# EasyEDA Pro project mini screen.eprj

# Schematic bad usb

## Sheets
1 rp2040: Board Name: bad udb; Create Date: 2025-10-08; Page Name: rp2040; Project Name: mini screen; Schematic Name: bad usb; Update Date: 2025-10-19; Company: EasyEDA.com; Page Size: A4; Version: V1.0
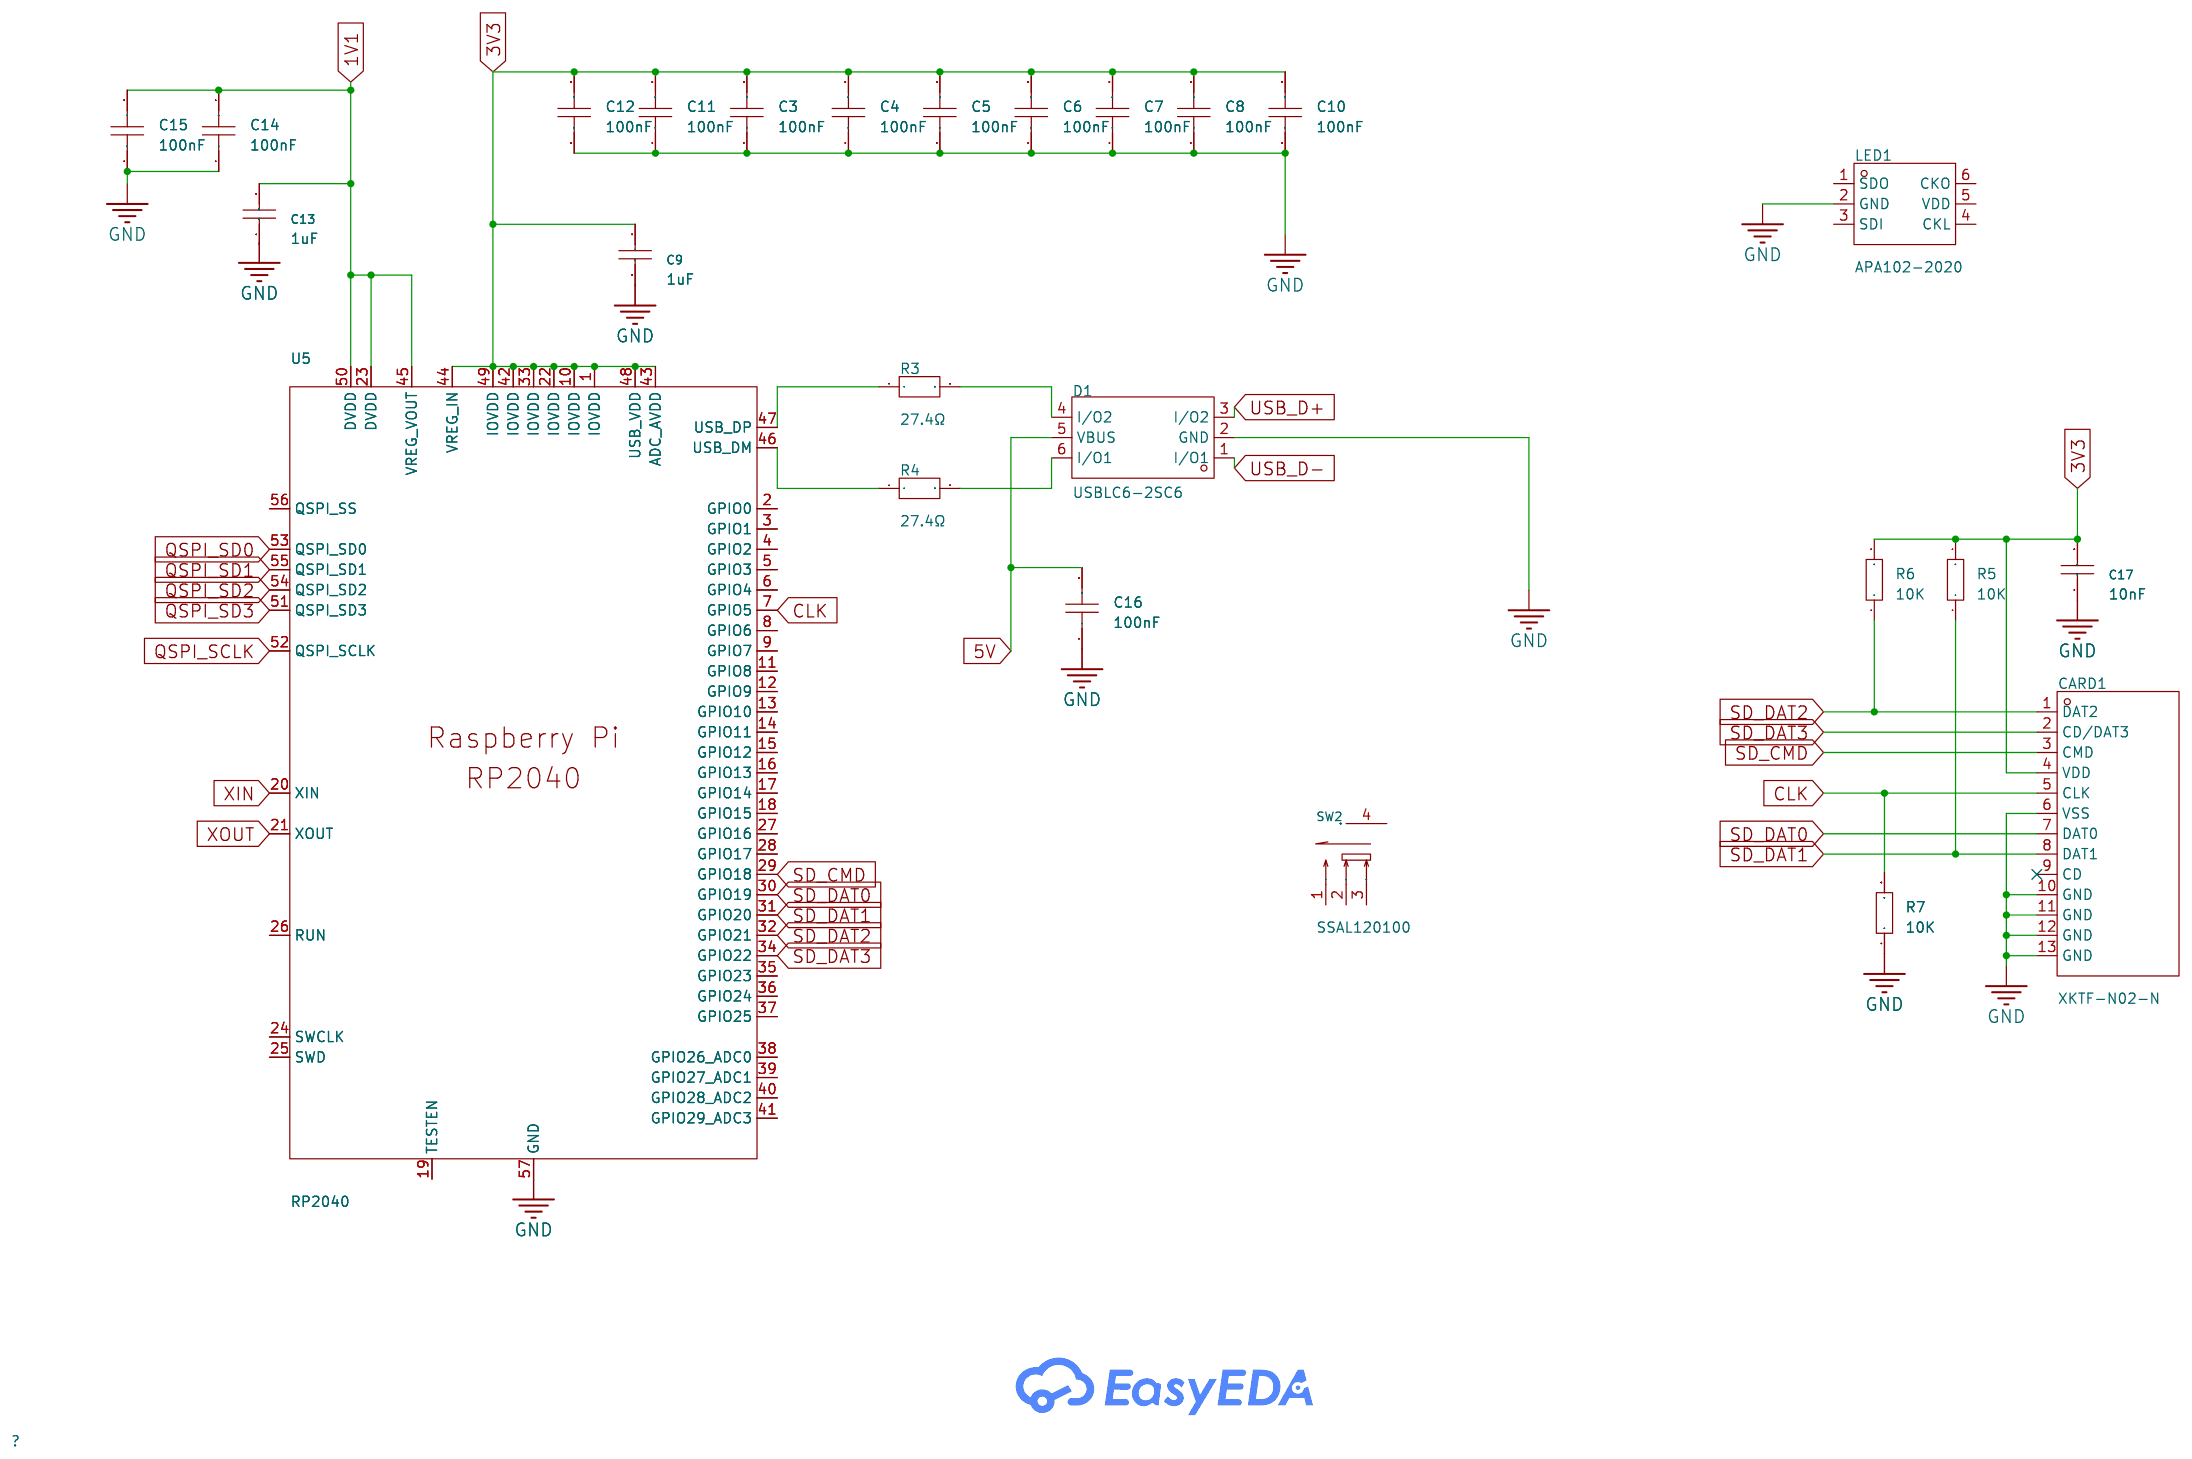
[diagram p0: rp2040]
2 usbc: Create Date: 2025-10-16; Page Name: usbc; Update Date: 2025-10-16
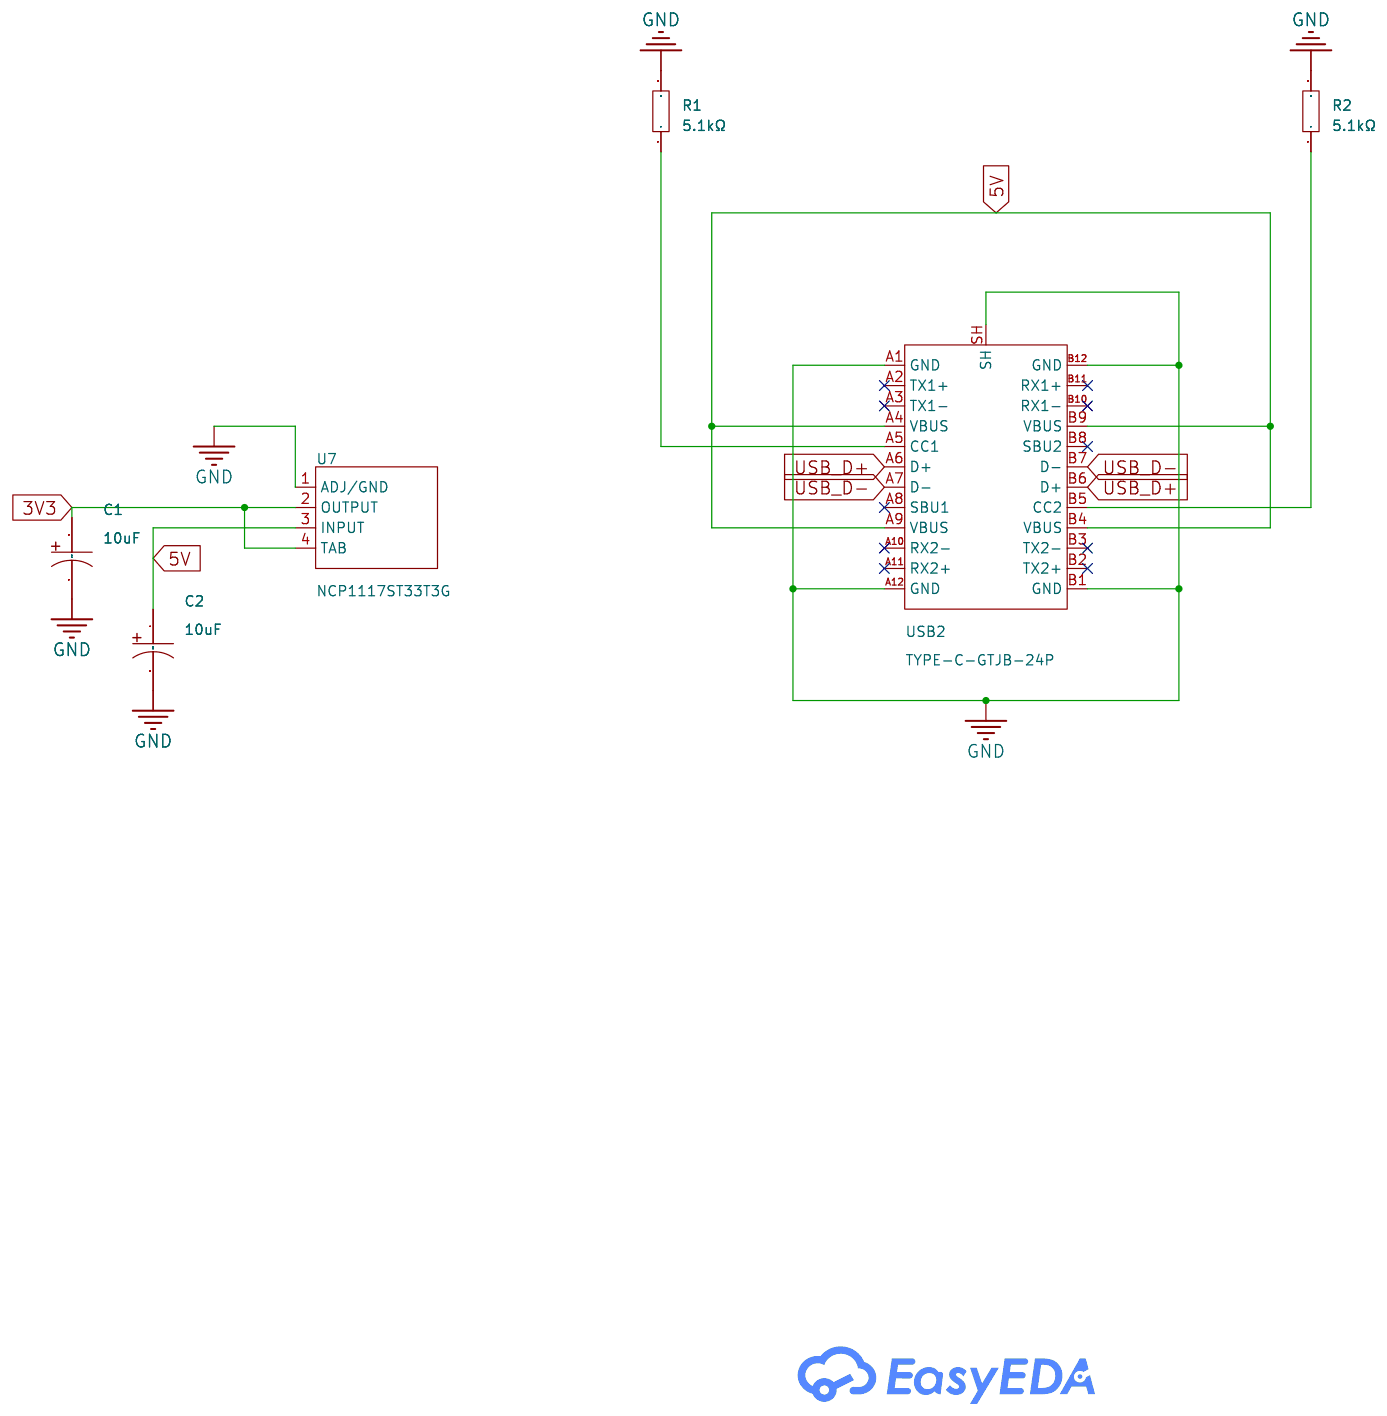
[diagram p1: usbc]
3 nand flash: Create Date: 2025-10-16; Page Name: nand flash; Update Date: 2025-10-16
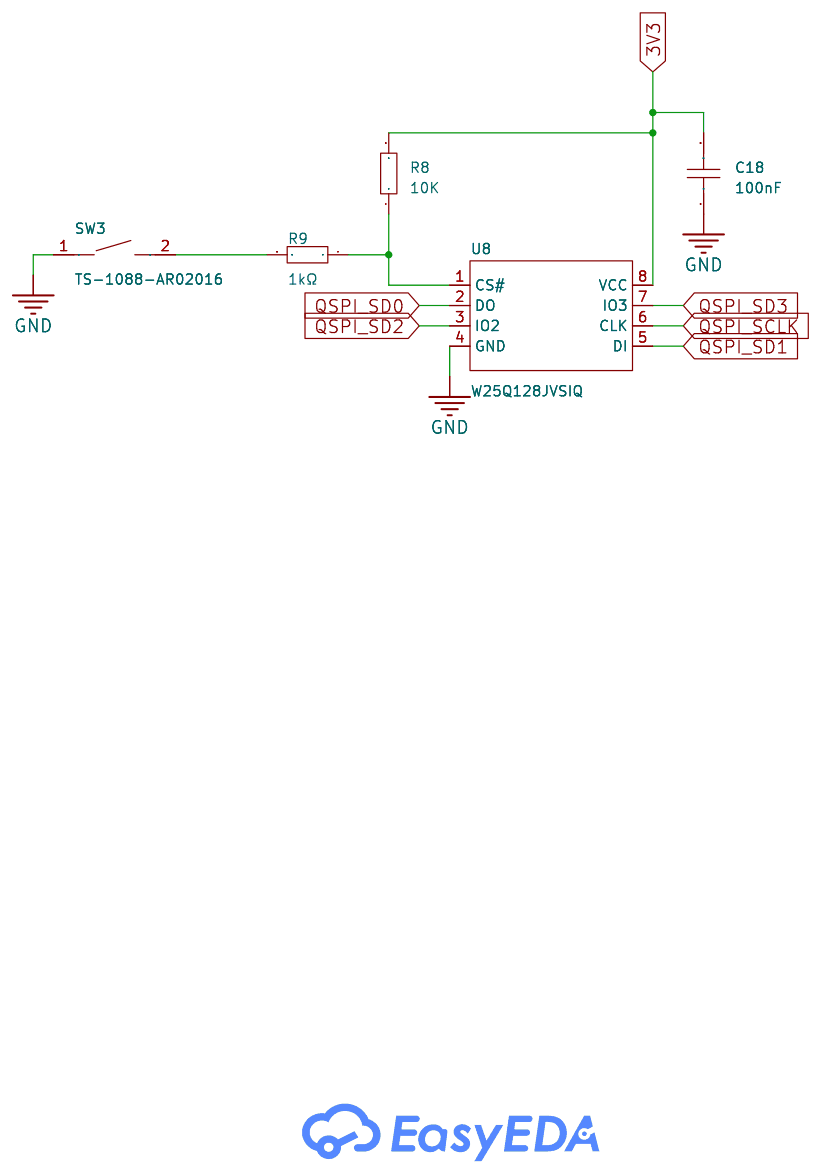
[diagram p2: nand flash]
4 clock: Create Date: 2025-10-19; Page Name: clock
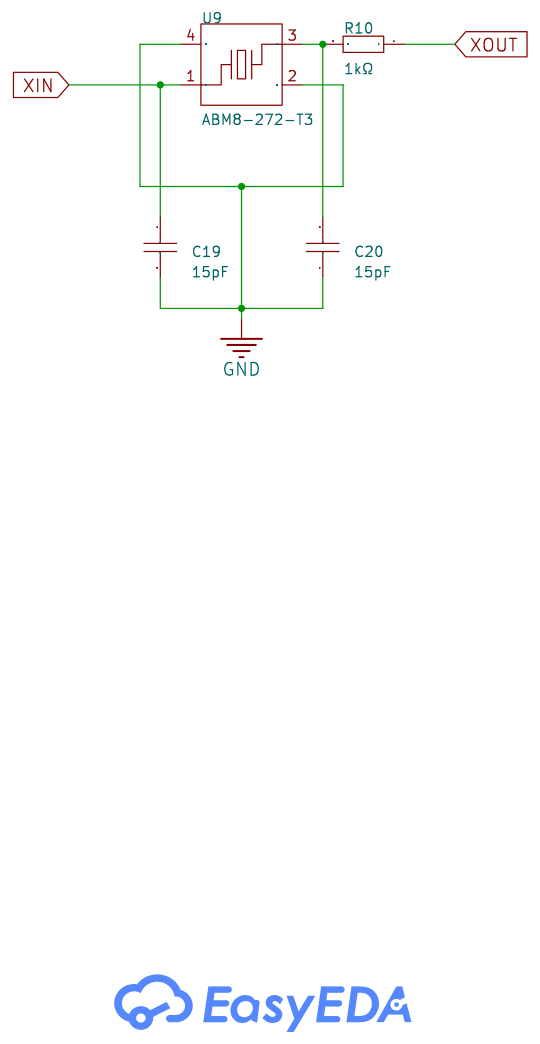
[diagram p3: clock]

## Parts
sheet clock
C19  15pF  [C0603]
C20  15pF  [C0603]
R10  1kΩ  [R0603]
U9  ABM8-272-T3  [CRYSTAL-SMD_4P-L3.2-W2.5-BL]
sheet nand flash
C18  100nF  [C0805]
R8  10K  [R0603]
R9  1kΩ  [R0603]
SW3  TS-1088-AR02016  [SW-SMD_L3.9-W3.0-P4.45]
U8  W25Q128JVSIQ  [SOIC-8_L5.3-W5.3-P1.27-LS8.0-BL]
sheet rp2040
C3  100nF  [C0805]
C4  100nF  [C0805]
C5  100nF  [C0805]
C6  100nF  [C0805]
C7  100nF  [C0805]
C8  100nF  [C0805]
C9  1uF  [C0805]
C10  100nF  [C0805]
C11  100nF  [C0805]
C12  100nF  [C0805]
C13  1uF  [C0805]
C14  100nF  [C0805]
C15  100nF  [C0805]
C16  100nF  [C0805]
C17  10nF  [C0603]
CARD1  XKTF-N02-N  [TF-SMD_XKTF-N02-N]
D1  USBLC6-2SC6  [SOT-23-6_L2.9-W1.6-P0.95-LS2.8-BL]
LED1  APA102-2020  [LED-SMD_6P-L2.0-W2.0-P0.80-TL]
R3  27.4Ω  [R0603]
R4  27.4Ω  [R0603]
R5  10K  [R0603]
R6  10K  [R0603]
R7  10K  [R0603]
SW2  SSAL120100  [SW-SMD_SSAL120100]
U5  RP2040  [QFN-56_L7.0-W7.0-P0.40-TL-EP4.0]
sheet usbc
C1  10uF  [CAP-SMD_BD4.0-L4.3-W4.3-FD]
C2  10uF  [CAP-SMD_BD4.0-L4.3-W4.3-FD]
R1  5.1kΩ  [R0603]
R2  5.1kΩ  [R0603]
U7  NCP1117ST33T3G  [SOT-223-3_L6.5-W3.4-P2.30-LS7.0-BR]
USB2  TYPE-C-GTJB-24P  [USB-C-SMD_TYPE-C-GTJB-24P]

## Library data of the parts
C19 C20 = CL10C150JB8NNNC: LCSC Part Name: 15pF ±5% 50V; Supplier Part: C1644; Manufacturer: SAMSUNG(三星); Supplier Footprint: 0603; JLCPCB Part Class: Basic Part; Datasheet: https://item.szlcsc.com/datasheet/CL10C150JB8NNNC/1996.html; Supplier: LCSC; Tolerance: ±5%; Voltage Rating: 50V; Temperature Coefficient: C0G
R9 R10 = 0603WAF1001T5E: LCSC Part Name: 1kΩ ±1% 100mW 厚膜电阻; Supplier Part: C21190; Manufacturer: UNI-ROYAL(厚声); Supplier Footprint: 0603; JLCPCB Part Class: Basic Part; Datasheet: https://atta.szlcsc.com/upload/public/pdf/source/20200306/C422600_1E6D84923E4A46A82E41ADD87F860B5C.pdf; Supplier: LCSC; Type: Thick Film Resistors; Tolerance: ±1%; Temperature Coefficient: ±100ppm/℃; Operating Temperature Range: -55℃~+155℃
U9 = ABM8-272-T3_C20625731: Supplier Part: C20625731; Manufacturer: ABRACON; Supplier Footprint: SMD3225-4P; JLCPCB Part Class: Extended Part; Datasheet: https://item.szlcsc.com/datasheet/ABM8-272-T3/22032038.html; Supplier: LCSC
C3-C8 C10-C12 C14-C16 C18 = CC0805KRX7R9BB104: LCSC Part Name: 100nF ±10% 50V; Supplier Part: C49678; Manufacturer: YAGEO(国巨); Supplier Footprint: 0805; JLCPCB Part Class: Basic Part; Datasheet: https://item.szlcsc.com/datasheet/CC0805KRX7R9BB104/50686.html; Supplier: LCSC; Tolerance: ±10%; Voltage Rating: 50V; Temperature Coefficient: X7R
R5-R8 = Res_0603: Supplier Footprint: 0603
SW3 = TS-1088-AR02016: LCSC Part Name: 4*3*2mm 立贴 轻触开关; Supplier Part: C720477; Manufacturer: XUNPU(讯普); Supplier Footprint: SMD; JLCPCB Part Class: Basic Part; Datasheet: https://item.szlcsc.com/datasheet/TS-1088-AR02016/763484.html; Supplier: LCSC; Circuit: SPST; Actuator Style: Round Button; Operating Force: 1.6N; Mounting Type: Surface Mount,Vertical; Length: 4mm; Width: 3mm; Switch Height: 2mm; with Bracket: Without Bracket; Contact Current: 50mA; Voltage Rating: 12V; Actuator/Cap Color: Black; Termination Style: SMD(SMT) Tab; Life: 100,000 Cycles; Operating Temperature: -30℃~+80℃
U8 = W25Q128JVSIQ: LCSC Part Name: 编带 支持双路/四路SPI接口的3V、128Mbit 串行闪存; Supplier Part: C97521; Manufacturer: Winbond(华邦); Supplier Footprint: SOIC-8-208mil; JLCPCB Part Class: Basic Part; Datasheet: https://item.szlcsc.com/datasheet/W25Q128JVSIQ/98729.html; Supplier: LCSC; Interface: SPI; Memory Size: 128Mbit; Clock Frequency: 133MHz; Voltage - Supply: 2.7V~3.6V; Standby Supply Current: 1uA; Program / Erase Cycles: 100,000 Cycles; Page Programming Time (Tpp): 3ms; Block Erase Time(tBE): 120ms@(32KB); Data Retention - TDR (Year): 20 Years; Operating Temperature: -40℃~+85℃
C9 C13 = CL21B105KBFNNNE: LCSC Part Name: 1uF ±10% 50V; Supplier Part: C28323; Manufacturer: SAMSUNG(三星); Supplier Footprint: 0805; JLCPCB Part Class: Basic Part; Datasheet: https://item.szlcsc.com/datasheet/CL21B105KBFNNNE/29074.html; Supplier: LCSC; Tolerance: ±10%; Voltage Rating: 50V; Temperature Coefficient: X7R
C17 = 0603B103K500NT: LCSC Part Name: 10nF ±10% 50V; Supplier Part: C57112; Manufacturer: FH(风华); Supplier Footprint: 0603; JLCPCB Part Class: Basic Part; Datasheet: https://item.szlcsc.com/datasheet/0603B103K500NT/58143.html; Supplier: LCSC; Tolerance: ±10%; Voltage Rating: 50V; Temperature Coefficient: X7R
CARD1 = XKTF-N02-N: LCSC Part Name: 自弹式 MicroSD卡(TF卡) 卡座; Supplier Part: C381084; Manufacturer: XKB Connection(中国星坤); Supplier Footprint: SMD; JLCPCB Part Class: Extended Part; Datasheet: https://item.szlcsc.com/datasheet/XKTF-N02-N/353316.html; Supplier: LCSC; Card Connection Mode: Push-Push; Card Type: MicroSD Card (TF Card); Connector Type: Connector and Ejector; Height Above Board: 2mm; Operating Temperature: -25℃~+90℃
D1 = USBLC6-2SC6_C2687116: Supplier Part: C2687116; Manufacturer: UMW(友台半导体); Supplier Footprint: SOT-23-6; JLCPCB Part Class: Extended Part; Datasheet: https://atta.szlcsc.com/upload/public/pdf/source/20231109/512642D850D9873E7C519F71E85B9A10.pdf; Supplier: LCSC; Maximum Clamping Voltage: 15V; Breakdown Voltage: 6V; Number of Lines: 双路; Type: ESD
LED1 = APA102-2020: Supplier Part: C9900001305; Supplier Footprint: LED-SMD-6_2.0X2.0X0.80P; JLCPCB Part Class: Extended Part; Supplier: LCSC
R3 R4 = FRC0603F27R4TS: LCSC Part Name: 27.4Ω ±1% 100mW 厚膜电阻; Supplier Part: C5126244; Manufacturer: FOJAN(富捷); Supplier Footprint: 0603; JLCPCB Part Class: Extended Part; Supplier: LCSC; Type: Thick Film Resistor; Tolerance: ±1%; Power(Watts): 100mW; Voltage-Supply(Max): 75V; Temperature Coefficient: ±100ppm/℃; Operating Temperature: -55℃~+155℃
SW2 = SSAL120100: Supplier Part: C335996; Manufacturer: ALPSALPINE(阿尔卑斯阿尔派); Supplier Footprint: SMD; JLCPCB Part Class: Extended Part; Datasheet: https://item.szlcsc.com/datasheet/SSAL120100/314151.html; Supplier: LCSC; Circuit: SPDT; Actuator Style: Rectangular Columnar; Termination Style: SMD(SMT) Tab; Switch Height: 4.1mm; Mounting Type: Surface Mount, Right Angle; Current Rating: 10mA; Voltage Rating: 5V; Life: 100,000 Cycles; Operating Temperature: -10℃~+60℃
U5 = RP2040: Supplier Part: C2961140; Manufacturer: Raspberry Pi(树莓派); Supplier Footprint: QFN-56-EP(7x7); JLCPCB Part Class: Extended Part; Datasheet: https://atta.szlcsc.com/upload/public/pdf/source/20220208/8D54DD1C91A7987165C42A5C4D6BB336.pdf; Supplier: LCSC
C1 C2 = EEEHP1A100R: LCSC Part Name: 10uF ±20% 10V; Supplier Part: C401860; Manufacturer: PANASONIC(松下); Supplier Footprint: SMD,D4xL5.8mm; JLCPCB Part Class: Extended Part; Datasheet: https://item.szlcsc.com/datasheet/EEEHP1A100R/386788.html; Supplier: LCSC; Tolerance: ±20%; Voltage Rating: 10V; Ripple Current: 20mA@120Hz; Diameter: 4mm; Height - Seated (Max): 5.9mm; Lifetime: 2000hrs@105℃; Operating Temperature: -40℃~+105℃
R1 R2 = 0603WAF5101T5E: LCSC Part Name: 5.1kΩ ±1% 100mW 厚膜电阻; Supplier Part: C23186; Manufacturer: UNI-ROYAL(厚声); Supplier Footprint: 0603; JLCPCB Part Class: Basic Part; Datasheet: https://item.szlcsc.com/datasheet/0603WAF5101T5E/23913.html; Supplier: LCSC; Type: Thick Film Resistor; Tolerance: ±1%; Power(Watts): 100mW; Voltage-Supply(Max): 75V; Temperature Coefficient: ±100ppm/℃; Operating Temperature: -55℃~+155℃
U7 = NCP1117ST33T3G: LCSC Part Name: 输入20V 输出3.3V 1A; Supplier Part: C26537; Manufacturer: onsemi(安森美); Supplier Footprint: SOT-223; JLCPCB Part Class: Extended Part; Datasheet: https://item.szlcsc.com/datasheet/NCP1117ST33T3G/27282.html; Supplier: LCSC; Output Type: Fixed; Voltage - Supply: 20V; Output Voltage: 3.3V; Output Current: 1A; Power Supply Rejection Ratio (PSRR): 62dB@(120Hz); Voltage Dropout: 1.2V@(800mA); standby current: 6mA; Noise: 0.003%Vout; Features: Thermal Shutdown；Over Current Protection; Operating Temperature: 0℃~+125℃@(Ta); Output Configuration: Positive; Number of Outputs: 1
USB2 = TYPE-C-GTJB-24P: LCSC Part Name: Type-C 公 夹板; Supplier Part: C42418805; Manufacturer: JXTCONN(聚兴泰); Supplier Footprint: SMD; JLCPCB Part Class: Extended Part; Datasheet: https://item.szlcsc.com/datasheet/TYPE-C-GTJB-24P/44427956.html; Supplier: LCSC; Connector Type: Type-C; Gender: Male; Mounting Type: Clamp Plate; Number of Contacts: 24P; Number of Ports: 1; Current Rating-Power: 3A; Connect-Disconnect Life: 3,000 Cycles; Length: 10.4mm

## Nets
1V1: C13.2 C14.2 C15.2 U5.23(DVDD) U5.45(VREG_VOUT) U5.50(DVDD)
3V3: C1.1 C3.2 C4.2 C5.2 C6.2 C7.2 C8.2 C9.2 C10.2 C11.2 C12.2 C17.2 C18.2 CARD1.4(VDD) R5.2 R6.2 R8.2 U5.1(IOVDD) U5.10(IOVDD) U5.22(IOVDD) U5.33(IOVDD) U5.42(IOVDD) U5.43(ADC_AVDD) U5.44(VREG_IN) U5.48(USB_VDD) U5.49(IOVDD) U7.2(OUTPUT) U7.4(TAB) U8.8(VCC)
5V: C2.1 C16.2 D1.5(VBUS) U7.3(INPUT) USB2.A4(VBUS) USB2.A9(VBUS) USB2.B4(VBUS) USB2.B9(VBUS)
GND: C1.2 C2.2 C3.1 C4.1 C5.1 C6.1 C7.1 C8.1 C9.1 C10.1 C11.1 C12.1 C13.1 C14.1 C15.1 C16.1 C17.1 C18.1 C19.2 C20.1 CARD1.6(VSS) CARD1.10(GND) CARD1.11(GND) CARD1.12(GND) CARD1.13(GND) D1.2(GND) LED1.2(GND) R1.2 R2.2 R7.1 SW3.1 U5.57(GND) U7.1(ADJ/GND) U8.4(GND) U9.2(GND) U9.4(GND) USB2.A1(GND) USB2.A12(GND) USB2.B1(GND) USB2.B12(GND) USB2.SH
CLK: CARD1.5(CLK) R7.2 U5.7(GPIO5)
QSPI_SCLK: U5.52(QSPI_SCLK) U8.6(CLK)
QSPI_SD0: U5.53(QSPI_SD0) U8.2(DO)
QSPI_SD1: U5.55(QSPI_SD1) U8.5(DI)
QSPI_SD2: U5.54(QSPI_SD2) U8.3(IO2)
QSPI_SD3: U5.51(QSPI_SD3) U8.7(IO3)
SD_CMD: CARD1.3(CMD) U5.29(GPIO18)
SD_DAT0: CARD1.7(DAT0) U5.30(GPIO19)
SD_DAT1: CARD1.8(DAT1) R5.1 U5.31(GPIO20)
SD_DAT2: CARD1.1(DAT2) R6.1 U5.32(GPIO21)
SD_DAT3: CARD1.2(CD/DAT3) U5.34(GPIO22)
USB_D+: D1.3(I/O2) USB2.A6(D+) USB2.B6(D+)
USB_D-: D1.1(I/O1) USB2.A7(D-) USB2.B7(D-)
XIN: C19.1 U5.20(XIN) U9.1
XOUT: R10.1 U5.21(XOUT)
$1N4416: D1.4(I/O2) R3.2
$1N4421: D1.6(I/O1) R4.2
$1N4426: R4.1 U5.46(USB_DM)
$1N4431: R3.1 U5.47(USB_DP)
$2N850: R2.1 USB2.B5(CC2)
$2N855: R1.1 USB2.A5(CC1)
$3N520: R8.1 R9.1 U8.1(CS#)
$3N750: R9.2 SW3.2
$4N535: C20.2 R10.2 U9.3

Not connected (* = marked no-connect by the designer): CARD1 9(CD)*; LED1 1(SDO) 3(SDI) 4(CKL) 5(VDD) 6(CKO); SW2 1 2 3 4(SHELL); U5 2(GPIO0) 3(GPIO1) 4(GPIO2) 5(GPIO3) 6(GPIO4) 8(GPIO6) 9(GPIO7) 11(GPIO8) 12(GPIO9) 13(GPIO10) 14(GPIO11) 15(GPIO12) 16(GPIO13) 17(GPIO14) 18(GPIO15) 19(TESTEN) 24(SWCLK) 25(SWD) 26(RUN) 27(GPIO16) 28(GPIO17) 35(GPIO23) 36(GPIO24) 37(GPIO25) 38(GPIO26_ADC0) 39(GPIO27_ADC1) 40(GPIO28_ADC2) 41(GPIO29_ADC3) 56(QSPI_SS); USB2 A2(TX1+)* A3(TX1-)* A8(SBU1)* A10(RX2-)* A11(RX2+)* B2(TX2+)* B3(TX2-)* B8(SBU2)* B10(RX1-)* B11(RX1+)*

# Board PCB1
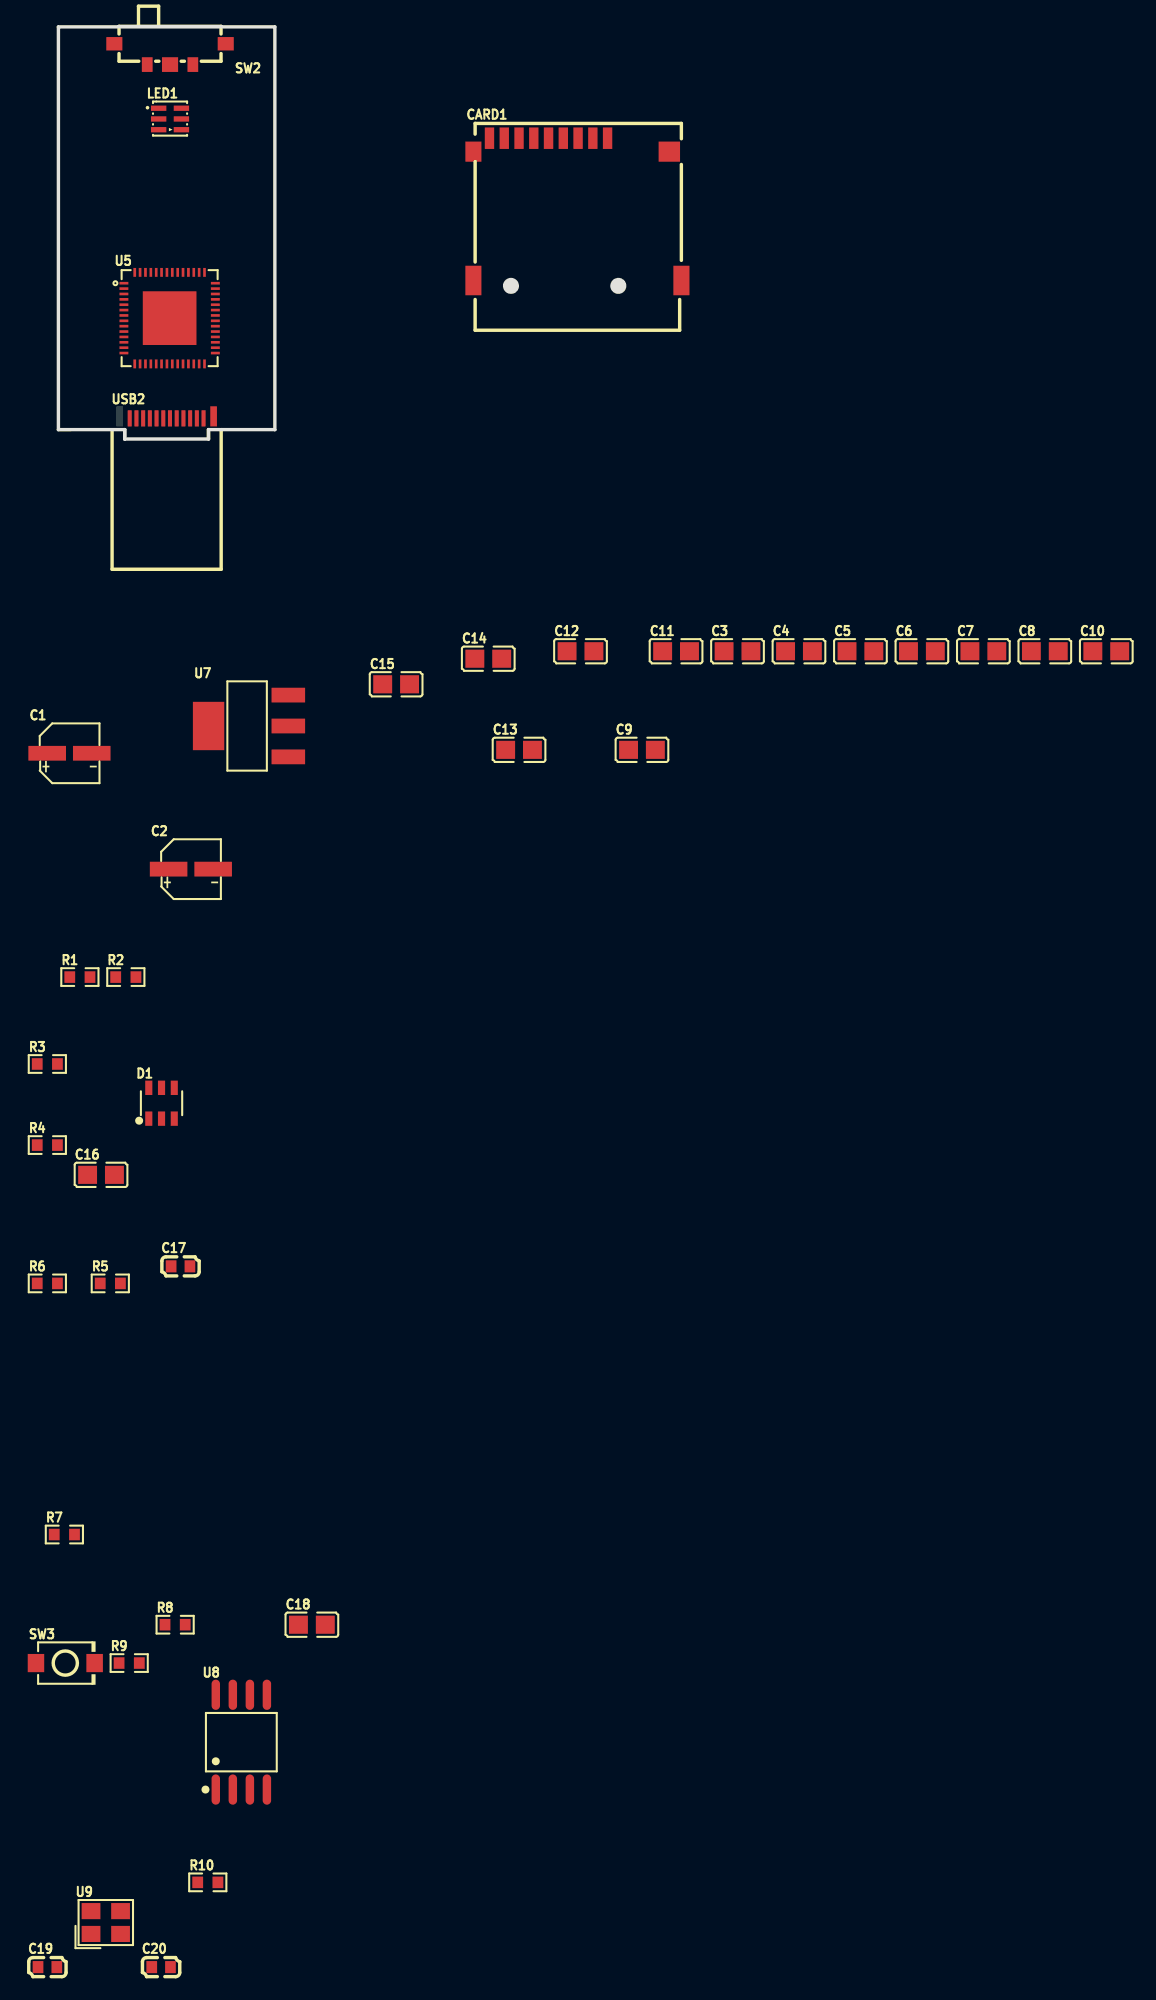
[diagram p4: board, top side]
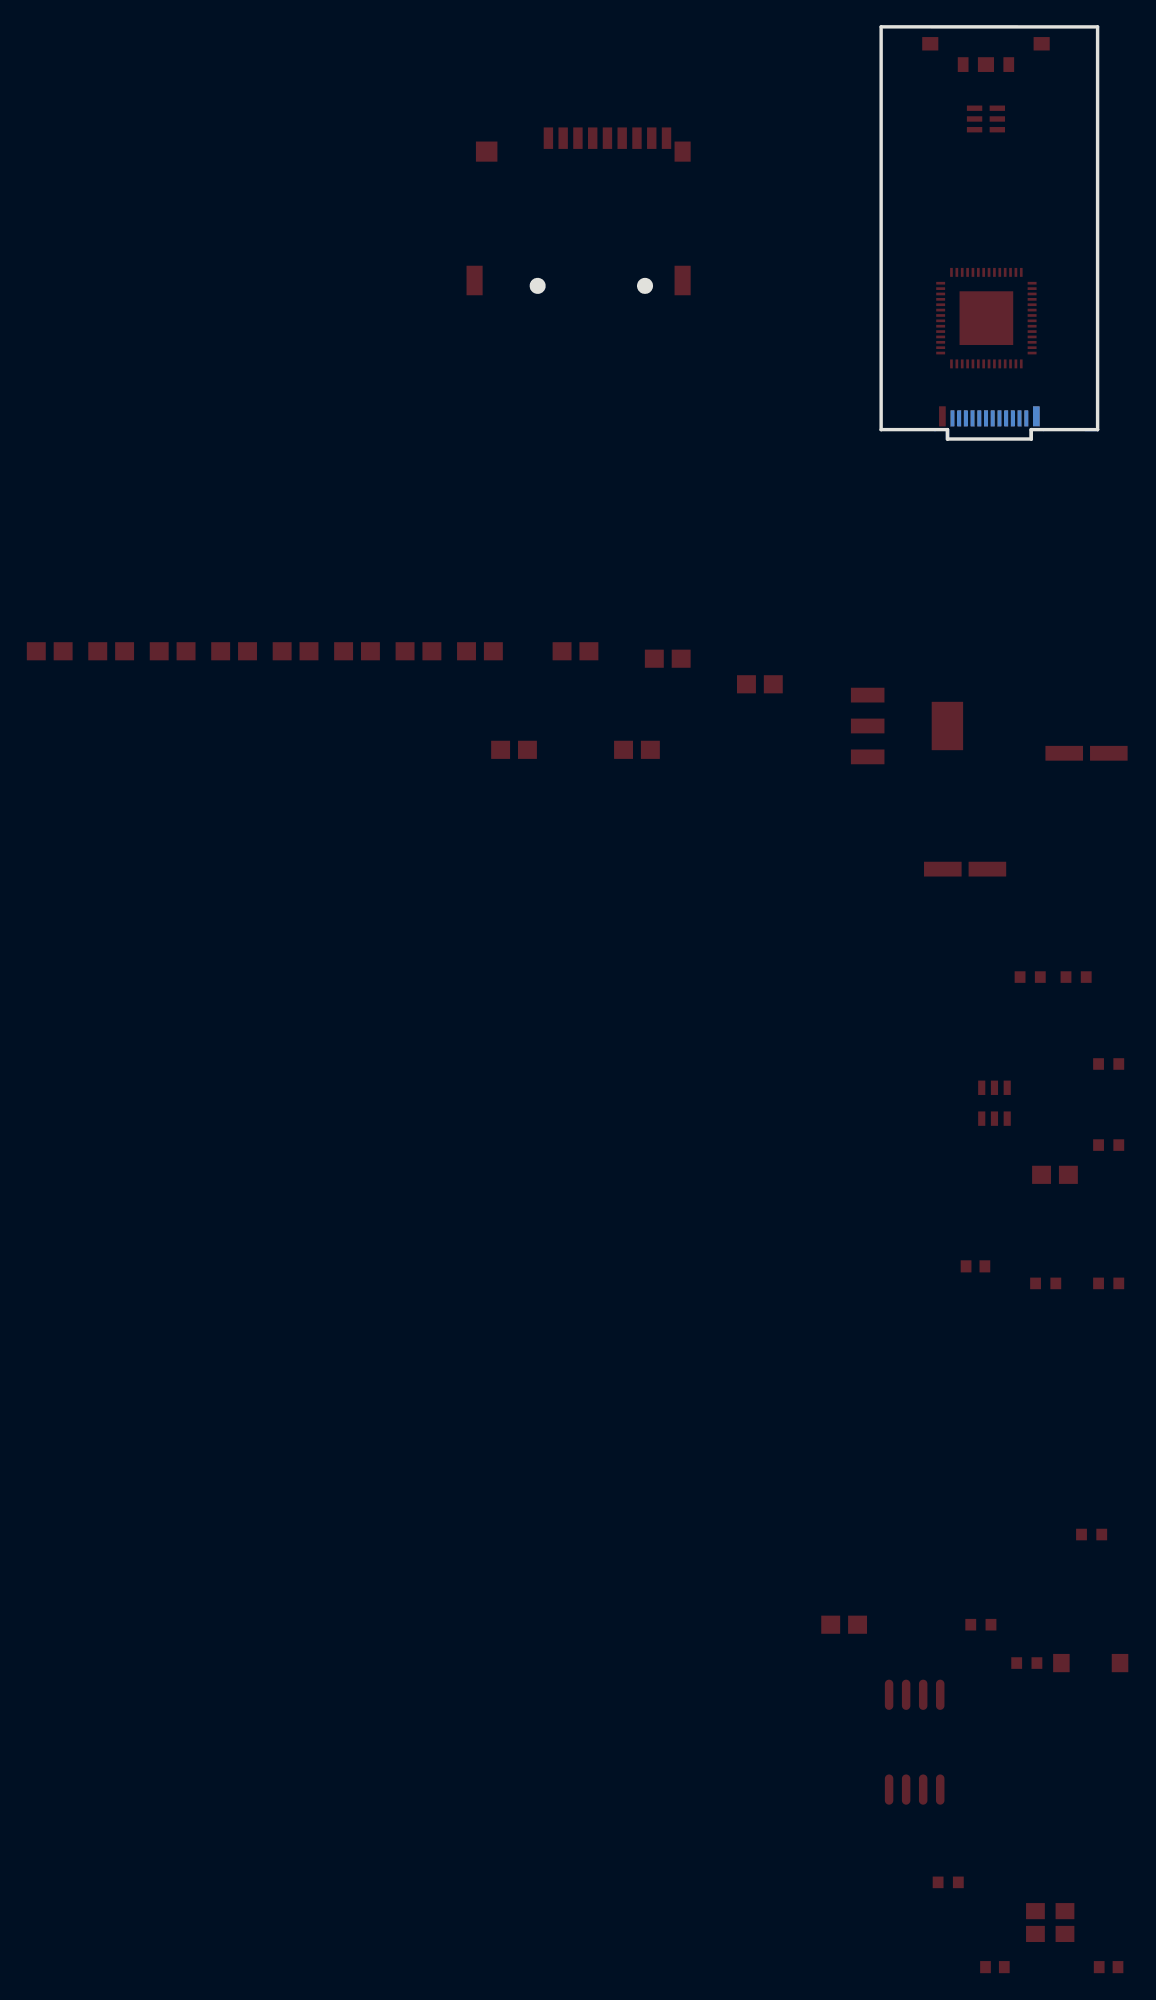
[diagram p5: board, bottom side, seen from below]

Outline 42.32 x 30.7 mm; copper layers: Top Layer, Bottom Layer. Coordinates in mm from the lower left corner of the outline.
Outline path: 4,0.7 0,0.7 0,30.7 16.13,30.7 16.13,0.7 12.13,0.7
Stack: Top Layer 0.035mm / Dielectric1 1.51mm FR4 er 4.5 / Bottom Layer 0.035mm

## Design rules (mm)
template: JLCPCB Capability(Two Layers Board)
spacing copperThickness1oz (default): track to track 0.102, other pairs 0.152 to 0.3
spacing copperThickness2oz: track to track 0.203, other pairs 0.152 to 0.3
track width copperThickness1oz (default): min 0.127, default 0.254, max 2.54
track width copperThickness2oz: min 0.203, default 0.254, max 2.54
differential pair differentialPair (default): width min 0.127, default 0.254, max 2.54; gap min 0.152, default 0.152
via viaSize (default): diameter min 0.5, default 0.61, max 10; hole min 0.3, default 0.305, max 6.3

## Placement (name value [footprint] x y rotation side)
C1  10uF  [CAP-SMD_BD4.0-L4.3-W4.3-FD]  0.82 -23.41 0 top
C2  10uF  [CAP-SMD_BD4.0-L4.3-W4.3-FD]  9.87 -32.04 0 top
C3  100nF  [C0805]  50.6 -15.81 0 top
C4  100nF  [C0805]  55.18 -15.81 0 top
C5  100nF  [C0805]  59.76 -15.81 0 top
C6  100nF  [C0805]  64.34 -15.81 0 top
C7  100nF  [C0805]  68.92 -15.81 0 top
C8  100nF  [C0805]  73.5 -15.81 0 top
C9  1uF  [C0805]  43.48 -23.15 0 top
C10  100nF  [C0805]  78.08 -15.81 0 top
C11  100nF  [C0805]  46.02 -15.81 0 top
C12  100nF  [C0805]  38.9 -15.81 0 top
C13  1uF  [C0805]  34.32 -23.15 0 top
C14  100nF  [C0805]  32.03 -16.36 0 top
C15  100nF  [C0805]  25.16 -18.27 0 top
C16  100nF  [C0805]  3.18 -54.8 0 top
C17  10nF  [C0603]  9.1 -61.62 0 top
C18  100nF  [C0805]  18.89 -88.31 0 top
C19  15pF  [C0603]  -0.82 -113.81 0 top
C20  15pF  [C0603]  7.65 -113.81 0 top
CARD1  XKTF-N02-N  [TF-SMD_XKTF-N02-N]  38.67 17.11 0 top
D1  USBLC6-2SC6  [SOT-23-6_L2.9-W1.6-P0.95-LS2.8-BL]  7.68 -49.47 0 top
LED1  APA102-2020  [LED-SMD_6P-L2.0-W2.0-P0.80-TL]  8.32 23.84 0 top
R1  5.1kΩ  [R0603]  1.6 -40.07 0 top
R2  5.1kΩ  [R0603]  5.02 -40.07 0 top
R3  27.4Ω  [R0603]  -0.83 -46.55 0 top
R4  27.4Ω  [R0603]  -0.83 -52.59 0 top
R5  10K  [R0603]  3.87 -62.89 0 top
R6  10K  [R0603]  -0.83 -62.89 0 top
R7  10K  [R0603]  0.44 -81.59 0 top
R8  10K  [R0603]  8.7 -88.31 0 top
R9  1kΩ  [R0603]  5.28 -91.17 0 top
R10  1kΩ  [R0603]  11.13 -107.5 0 top
SW2  SSAL120100  [SW-SMD_SSAL120100]  8.32 28.66 180 top
SW3  TS-1088-AR02016  [SW-SMD_L3.9-W3.0-P4.45]  0.51 -91.17 0 top
U5  RP2040  [QFN-56_L7.0-W7.0-P0.40-TL-EP4.0]  8.29 9 0 top
U7  NCP1117ST33T3G  [SOT-223-3_L6.5-W3.4-P2.30-LS7.0-BR]  14.16 -21.37 0 top
U8  W25Q128JVSIQ  [SOIC-8_L5.3-W5.3-P1.27-LS8.0-BL]  13.63 -97.06 0 top
U9  ABM8-272-T3  [CRYSTAL-SMD_4P-L3.2-W2.5-BL]  3.53 -110.49 0 top
USB2  TYPE-C-GTJB-24P  [USB-C-SMD_TYPE-C-GTJB-24P]  8.06 1.61 0 top

## Footprints (pads in the part's own frame, mm; a bottom-side part is the same pattern mirrored in y, then rotated)
C0603
  rect 0.8x0.9 smd: 1(-0.7,0) 2(0.7,0)
C0805
  rect 1.41x1.35 smd: 1(-1,0) 2(1,0)
CAP-SMD_BD4.0-L4.3-W4.3-FD
  rect 2.8x1.1 smd: 1(-1.661,0) 2(1.661,0)
CRYSTAL-SMD_4P-L3.2-W2.5-BL
  rect 1.4x1.2 smd: 1(-1.1,-0.85) 2(1.1,-0.85) 3(1.1,0.85) 4(-1.1,0.85)
LED-SMD_6P-L2.0-W2.0-P0.80-TL
  rect 1.145x0.4 smd: 1(-0.848,0.8) 2(-0.848,0) 3(-0.848,-0.8) 4(0.848,-0.8) 5(0.848,0) 6(0.848,0.8)
QFN-56_L7.0-W7.0-P0.40-TL-EP4.0
  rect 0.665x0.2 smd: 1(-3.408,2.6) 2(-3.408,2.2) 3(-3.408,1.8) 4(-3.408,1.4) 5(-3.408,1) 6(-3.408,0.6) 7(-3.408,0.2) 8(-3.408,-0.2) 9(-3.408,-0.6) 10(-3.408,-1) 11(-3.408,-1.4) 12(-3.408,-1.8) 13(-3.408,-2.2) 14(-3.408,-2.6) 29(3.408,-2.6) 30(3.408,-2.2) 31(3.408,-1.8) 32(3.408,-1.4) 33(3.408,-1) 34(3.408,-0.6) 35(3.408,-0.2) 36(3.408,0.2) 37(3.408,0.6) 38(3.408,1) 39(3.408,1.4) 40(3.408,1.8) 41(3.408,2.2) 42(3.408,2.6)
  rect 0.2x0.665 smd: 15(-2.6,-3.408) 16(-2.2,-3.408) 17(-1.8,-3.408) 18(-1.4,-3.408) 19(-1,-3.408) 20(-0.6,-3.408) 21(-0.2,-3.408) 22(0.2,-3.408) 23(0.6,-3.408) 24(1,-3.408) 25(1.4,-3.408) 26(1.8,-3.408) 27(2.2,-3.408) 28(2.6,-3.408) 43(2.6,3.408) 44(2.2,3.408) 45(1.8,3.408) 46(1.4,3.408) 47(1,3.408) 48(0.6,3.408) 49(0.2,3.408) 50(-0.2,3.408) 51(-0.6,3.408) 52(-1,3.408) 53(-1.4,3.408) 54(-1.8,3.408) 55(-2.2,3.408) 56(-2.6,3.408)
  rect 4x4 smd: 57(0,0)
R0603
  rect 0.806x0.864 smd: 1(-0.753,0) 2(0.753,0)
SOIC-8_L5.3-W5.3-P1.27-LS8.0-BL
  oval 0.63x2.25 smd: 1(-1.905,-3.53) 2(-0.635,-3.53) 3(0.635,-3.53) 4(1.905,-3.53) 5(1.905,3.53) 6(0.635,3.53) 7(-0.635,3.53) 8(-1.905,3.53)
SOT-23-6_L2.9-W1.6-P0.95-LS2.8-BL
  rect 0.532x1.072 smd: 1(-0.95,-1.149) 2(0,-1.149) 3(0.95,-1.149) 4(0.95,1.149) 5(0,1.149) 6(-0.95,1.149)
SOT-223-3_L6.5-W3.4-P2.30-LS7.0-BR
  rect 2.5x1.1 smd: 1(2.97,-2.3) 2(2.97,0) 3(2.97,2.3)
  rect 2.34x3.6 smd: 4(-2.97,0)
SW-SMD_L3.9-W3.0-P4.45
  rect 1.23x1.36 smd: 1(-2.185,0) 2(2.185,0)
SW-SMD_SSAL120100
  rect 0.8x1.1 smd: 1(-1.7,0.775) 3(1.7,0.775)
  rect 1.2x1.1 smd: 2(0,0.775)
  rect 1.2x1 smd: 4(-4.15,-0.775) 4(4.15,-0.775)
TF-SMD_XKTF-N02-N
  rect 0.7x1.6 smd: 1(2.25,5.3) 2(1.15,5.3) 3(0.05,5.3) 4(-1.05,5.3) 5(-2.15,5.3) 6(-3.25,5.3) 7(-4.35,5.3) 8(-5.45,5.3) 9(-6.55,5.3)
  rect 1.2x1.5 smd: 10(-7.75,4.3)
  rect 1.2x2.2 smd: 11(-7.75,-5.3) 13(7.75,-5.3)
  rect 1.6x1.5 smd: 12(6.85,4.3)
USB-C-SMD_TYPE-C-GTJB-24P
  rect 0.3x1.2 smd far side: A1(-2.749,-0.075) A2(-2.249,-0.075) A3(-1.748,-0.075) A4(-1.248,-0.075) A5(-0.75,-0.075) A6(-0.25,-0.075) A7(0.251,-0.075) A8(0.75,-0.075) A9(1.251,-0.075) A10(1.752,-0.075) A11(2.251,-0.075) A12(2.749,-0.075)
  rect 0.3x1.2 smd: B1(2.749,-0.075) B2(2.25,-0.075) B3(1.75,-0.075) B4(1.251,-0.075) B5(0.75,-0.075) B6(0.25,-0.075) B7(-0.25,-0.075) B8(-0.75,-0.075) B9(-1.25,-0.075) B10(-1.748,-0.075) B11(-2.249,-0.075) B12(-2.749,-0.075)
  rect 0.5x1.5 smd far side: SH(-3.5,0.075)
  rect 0.5x1.5 smd: SH(3.5,0.075)

## Nets
As in the schematic.

Pads without a net: CARD1 9; LED1 1 3 4 5 6; SW2 1 2 3 4; U5 2 3 4 5 6 8 9 11 12 13 14 15 16 17 18 19 24 25 26 27 28 35 36 37 38 39 40 41 56; USB2 A2 A3 A8 A10 A11 B2 B3 B8 B10 B11
